# EAGLE design hbridge_2.0 (EAGLE 7.7.0)
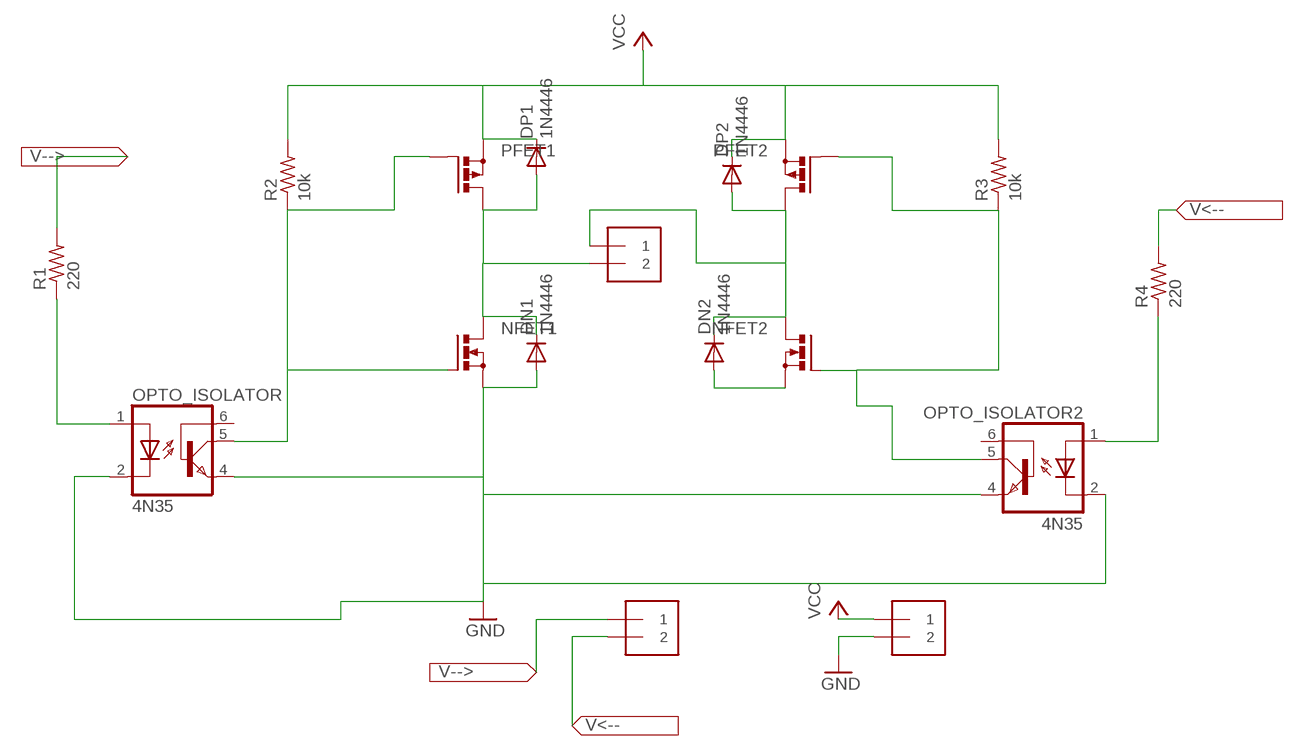
[diagram p0: schematic, sheet 1]

## Parts
ARDUINO  1X2-3.5MM  [1X2-3.5MM]
DN1  1N4446  [DO35-10]
DN2  1N4446  [DO35-10]
DP1  1N4446  [DO35-10]
DP2  1N4446  [DO35-10]
MOTOR  1X2-3.5MM  [1X2-3.5MM]
NFET1  PMOSFET_NTO220BH  [TO220BH]
NFET2  PMOSFET_NTO220BH  [TO220BH]
OPTO_ISOLATOR  4N35  [DIL06]
OPTO_ISOLATOR2  4N35  [DIL06]
PFET1  PMOSFET_PTO220BH  [TO220BH]
PFET2  PMOSFET_PTO220BH  [TO220BH]
POWER  1X2-3.5MM  [1X2-3.5MM]
R1  220  R-US_0207/15  [0207/15]
R2  10k  R-US_0207/15  [0207/15]
R3  10k  R-US_0207/15  [0207/15]
R4  220  R-US_0207/15  [0207/15]

## Nets
ARDUINO_A: ARDUINO.1 R1.2
ARDUINO_B: ARDUINO.2 R4.2
GND: DN1.A NFET1.S OPTO_ISOLATOR2.2(C) OPTO_ISOLATOR2.4(EMI) OPTO_ISOLATOR.2(C) OPTO_ISOLATOR.4(EMI) POWER.2
MOTOR1: DN2.C DP2.A MOTOR.1 NFET2.D PFET2.D
MOTOR2: DN1.C DP1.A MOTOR.2 NFET1.D PFET1.D
N$1: OPTO_ISOLATOR.1(A) R1.1
N$3: NFET1.G OPTO_ISOLATOR.5(COL) PFET1.G R2.1
N$4: OPTO_ISOLATOR2.1(A) R4.1
N$8: NFET2.G OPTO_ISOLATOR2.5(COL) PFET2.G R3.1
N$15: DN2.A NFET2.S
VCC: DP1.C DP2.C PFET1.S PFET2.S POWER.1 R2.2 R3.2
Unconnected: OPTO_ISOLATOR2.6(BAS) OPTO_ISOLATOR.6(BAS)

## Library data of the parts
ARDUINO MOTOR POWER = adafruit:1X2: 3.5mm Terminal block http://www.ladyada.net/library/pcb/eaglelibrary.html
DN1 DN2 DP1 DP2 = diode:1N4446: DIODE high speed (Philips)
NFET1 NFET2 = transistor-power:PMOSFET_N: Power MOSFET N-Channel
OPTO_ISOLATOR OPTO_ISOLATOR2 = optocoupler:4N35: MOTOROLA OPTO COUPLER; MF: FAIRCHILD SEMICONDUCTOR; MPN: 4N35; OC_FARNELL: 1328375; OC_NEWARK: 72K9946
PFET1 PFET2 = transistor-power:PMOSFET_P: Power MOSFET P-Channel
R1-R4 = adafruit:R-US_: RESISTOR, American symbol

## Board
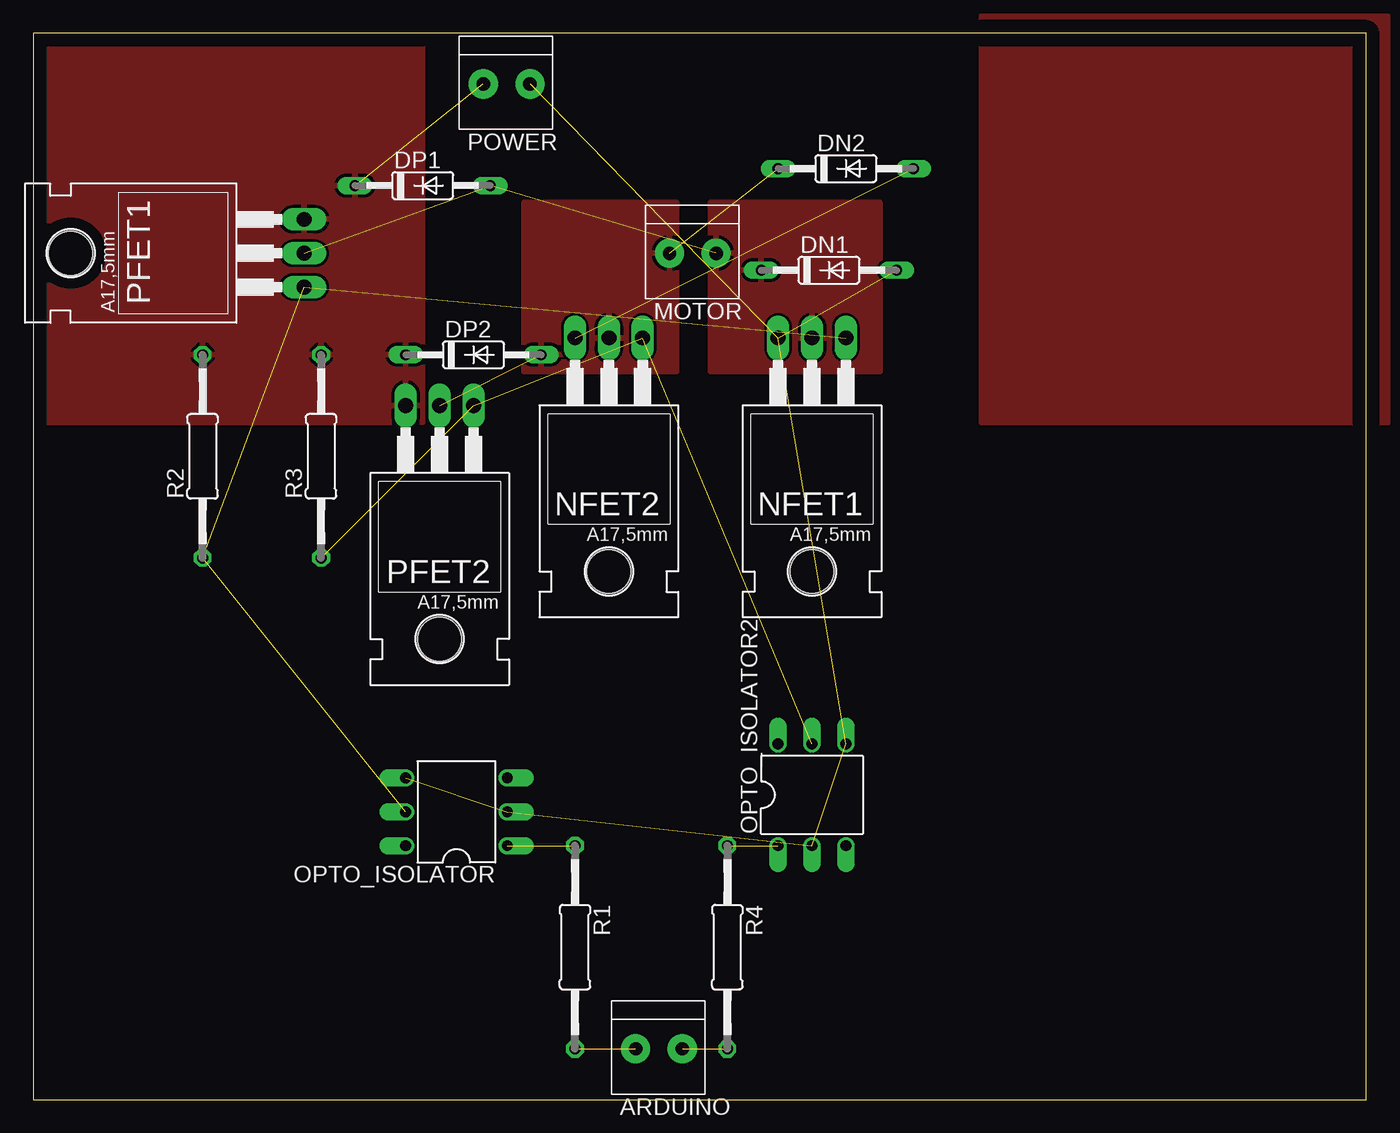
[diagram p1: board, top side]

Size 100 x 80 mm. Coordinates in mm from the lower left corner, seen from the top.
Outline: 0,0 100,0 100,80 0,80 0,0
Copper layers (1*16): Top 0.035mm / dielectric 1.5mm / Bottom 0.035mm
Design rules "default": minimum track width 10mil, minimum drill 24mil, track to track 8mil, track to pad 8mil, pad to pad 8mil, via to via 8mil, smd to smd 8mil, copper to edge 40mil, drill to drill 8mil, minimum pad ring 10mil, minimum via ring 8mil, stop-mask expansion 4mil, vias tented up to drill 0mil, thermal gap 10mil

### Footprints (pad centres in the part's own frame; a part is rotated, then mirrored left to right if it is on the bottom)
1X2-3.5MM = drill 1 pad 2.184: 1 1.8,0; 2 -1.7,0
DO35-10 = drill 0.813 long: A 5.08,0; C -5.08,0
TO220BH = drill 1.118 long: D 0,-6.35; G -2.54,-6.35; S 2.54,-6.35 | hole 3.302: 0,11.176
DIL06 = drill 0.813 offset: 1 -2.54,-3.81; 2 0,-3.81; 3 2.54,-3.81; 4 2.54,3.81; 5 0,3.81; 6 -2.54,3.81
0207/15 = drill 0.813 octagon: 1 -7.62,0; 2 7.62,0

### Placement (x,y rotation side)
ARDUINO  46.99,3.81 180 top
DN1  59.69,62.23 0 top
DN2  60.96,69.85 0 top
DP1  29.21,68.58 0 top
DP2  33.02,55.88 0 top
MOTOR  49.53,63.5 180 top
NFET1  58.42,50.8 180 top
NFET2  43.18,50.8 180 top
OPTO_ISOLATOR  31.75,21.59 90 top
OPTO_ISOLATOR2  58.42,22.86 0 top
PFET1  13.97,63.5 90 top
PFET2  30.48,45.72 180 top
POWER  35.56,76.2 180 top
R1  40.64,11.43 270 top
R2  12.7,48.26 90 top
R3  21.59,48.26 90 top
R4  52.07,11.43 270 top

### Tracks (layer width: path | path; a pad name or v marks a point on that pad's centre or on a via)
ARDUINO_A  (1 unrouted)
ARDUINO_B  (1 unrouted)
GND  (6 unrouted)
  pour Top: 101.6,81.28 101.6,50.8 71.12,50.8 71.12,81.28
MOTOR1  (2 unrouted)
  pour Top: 48.26,67.31 48.26,54.61 36.83,54.61 36.83,67.31
MOTOR2  (2 unrouted)
  pour Top: 63.5,67.31 50.8,67.31 50.8,54.61 63.5,54.61
N$1  (1 unrouted)
N$3  (3 unrouted)
N$4  (1 unrouted)
N$8  (3 unrouted)
N$15  (1 unrouted)
VCC  (1 unrouted)
  pour Top: -1.27,81.28 29.21,81.28 29.21,50.8 -1.27,50.8